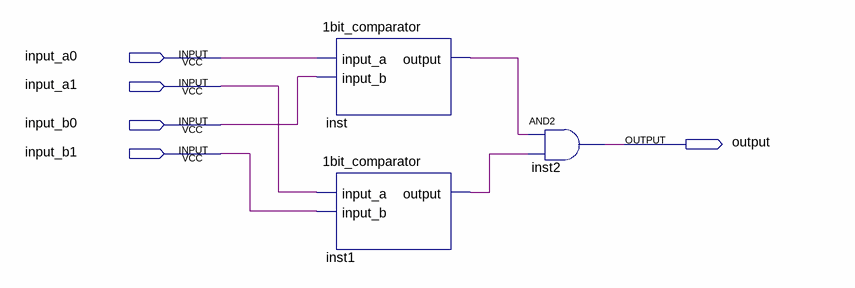
[diagram p0: schematic sheet]
// Quartus schematic 2bit_comparator2.bdf as structural Verilog: 3 symbols, 5 pins
module \2bit_comparator2  (
  input  input_a0,
  input  input_a1,
  input  input_b0,
  input  input_b1,
  output \output 
);

  wire inst1_output, inst_output;

  \1bit_comparator  inst (.input_a(input_a0), .input_b(input_b0), .\output (inst_output));
  \1bit_comparator  inst1 (.input_a(input_a1), .input_b(input_b1), .\output (inst1_output));
  and inst2 (\output , inst_output, inst1_output);
endmodule
